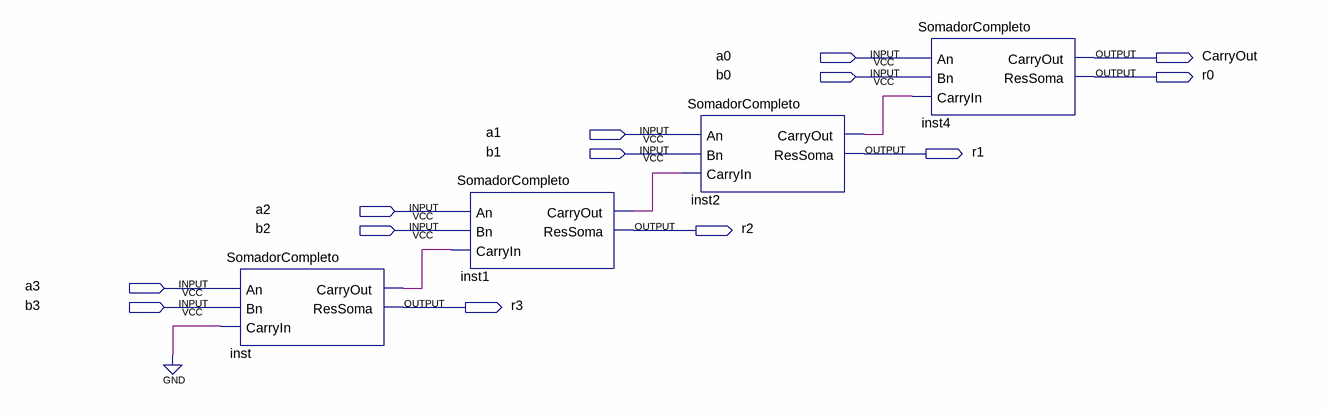
[diagram p0: schematic sheet]
// Quartus schematic 4BitsFullAdder.bdf as structural Verilog: 4 symbols, 13 pins
module \4BitsFullAdder  (
  input  a0,
  input  b0,
  input  a1,
  input  b1,
  input  a2,
  input  b2,
  input  a3,
  input  b3,
  output CarryOut,
  output r0,
  output r1,
  output r2,
  output r3
);

  wire inst1_carryout, inst2_carryout, inst_carryout;

  SomadorCompleto inst (.An(a3), .Bn(b3), .CarryIn(1'b0), .CarryOut(inst_carryout), .ResSoma(r3));
  SomadorCompleto inst1 (.An(a2), .Bn(b2), .CarryIn(inst_carryout), .CarryOut(inst1_carryout), .ResSoma(r2));
  SomadorCompleto inst2 (.An(a1), .Bn(b1), .CarryIn(inst1_carryout), .CarryOut(inst2_carryout), .ResSoma(r1));
  SomadorCompleto inst4 (.An(a0), .Bn(b0), .CarryIn(inst2_carryout), .CarryOut(CarryOut), .ResSoma(r0));
endmodule
